# EAGLE schematic WaterLevelControl (EAGLE 9.5.2)
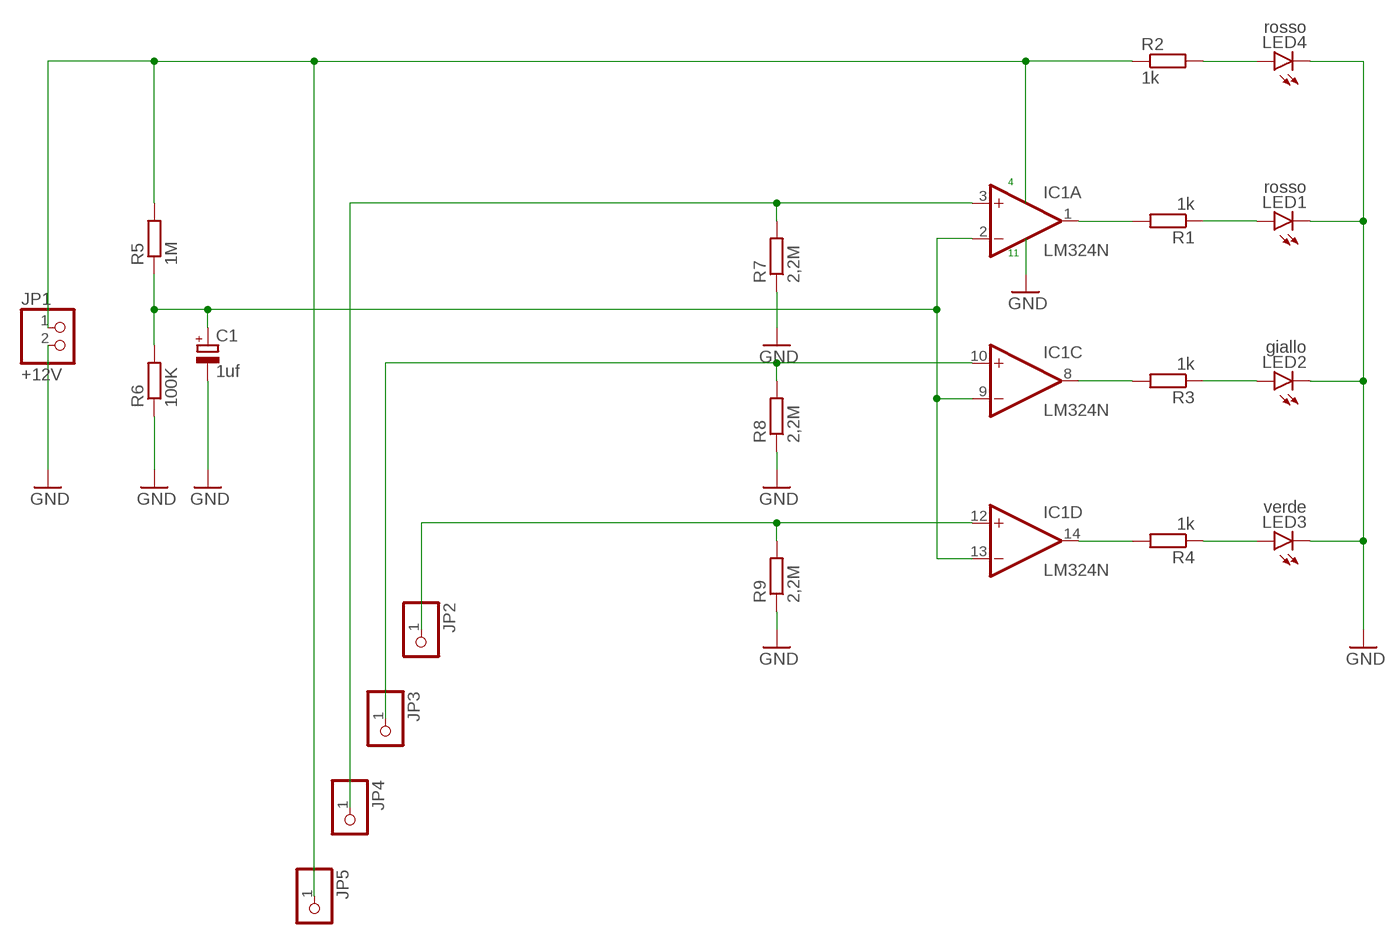
[diagram p0: schematic, sheet 1]

## Parts
C1  1uf  CPOL-EUE2.5-5  [E2,5-5]
IC1  LM324N  [DIL14]
JP1  +12V  PINHD-1X2  [1X02]
JP2  PINHD-1X1  [1X01]
JP3  PINHD-1X1  [1X01]
JP4  PINHD-1X1  [1X01]
JP5  PINHD-1X1  [1X01]
LED1  rosso  LED3MM  [LED3MM]
LED2  giallo  LED3MM  [LED3MM]
LED3  verde  LED3MM  [LED3MM]
LED4  rosso  LED3MM  [LED3MM]
R1  1k  R-EU_0207/10  [0207/10]
R2  1k  R-EU_0207/10  [0207/10]
R3  1k  R-EU_0207/10  [0207/10]
R4  1k  R-EU_0207/10  [0207/10]
R5  1M  R-EU_0207/10  [0207/10]
R6  100K  R-EU_0207/10  [0207/10]
R7  2,2M  R-EU_0207/10  [0207/10]
R8  2,2M  R-EU_0207/10  [0207/10]
R9  2,2M  R-EU_0207/10  [0207/10]

## Nets
+V: JP1.1 JP5.1 R2.1 R5.2
GND: C1.- JP1.2 LED1.K(C) LED2.K(C) LED3.K(C) LED4.K(C) R6.1 R7.1 R8.1 R9.1
N$1: IC1.3(A:+IN) JP4.1 R7.2
N$2: IC1.10(C:+IN) JP3.1 R8.2
N$3: IC1.12(D:+IN) JP2.1 R9.2
N$4: LED4.A R2.2
N$5: C1.+ IC1.2(A:-IN) IC1.9(C:-IN) IC1.13(D:-IN) R5.1 R6.2
N$7: LED1.A R1.1
N$8: LED2.A R3.1
N$9: IC1.8(C:OUT) R3.2
N$10: IC1.1(A:OUT) R1.2
N$11: IC1.14(D:OUT) R4.2
N$12: LED3.A R4.1
Unconnected: IC1.5(B:+IN) IC1.6(B:-IN) IC1.7(B:OUT)

## Notes on the sheet
- 4
- 11

## Power pins joined to a net without a drawn wire
V+: IC1.4(P:V+)
V-: IC1.11(P:V-)

## Library data of the parts
C1 = rcl-IK0JXV:CPOL-EU: POLARIZED CAPACITOR, European symbol; SPICEPREFIX: C
IC1 = linear-IK0JXV:LM324: OP AMP
JP1 = pinhead:PINHD-1X2: PIN HEADER
JP2-JP5 = pinhead:PINHD-1X1: PIN HEADER
LED1-LED4 = led-IK0JXV:LED: LED OSRAM: - CHIPLED LG R971, LG N971, LY N971, LG Q971, LY Q971, LO R971, LY R971 LH N974, LH R974 LS Q976, LO Q976, LY Q976 LO Q996 - Hyper CHIPLED LW Q18S LB Q993, LB Q99A, LB R99A - SideLED LS A670, LO A670, LY A670, LG A670, LP A670 LB A673, LV A673, LT A673, LW A673 LH A674 LY A675 LS A676, LA A676, LO A676, LY A676, LW A676 LS A679, LY A679, LG A679 - Hyper Micro SIDELED® LS Y876, LA Y876, LO Y876, LY Y876 LT Y87S - SmartLED LW L88C, LW L88S LB L89C, LB L89S, LG L890 LS L89K, LO L89K, LY L89K LS L896, LA L896, LO L896, LY L896 - TOPLED LS T670, LO T670, LY T670, LG T670, LP T670 LSG T670, LSP T670, LSY T670, LOP T670, LYG T670 LG T671, LOG T671, LSG T671 LB T673, LV T673, LT T673, LW T673 LH T674 LS T676, LA T676, LO T676, LY T676, LB T676, LH T676, LSB T676, LW T676 LB T67C, LV T67C, LT T67C, LS T67K, LO T67K, LY T67K, LW E67C LS E67B, LA E67B, LO E67B, LY E67B, LB E67C, LV E67C, LT E67C LW T67C LS T679, LY T679, LG T679 LS T770, LO T770, LY T770, LG T770, LP T770 LB T773, LV T773, LT T773, LW T773 LH T774 LS E675, LA E675, LY E675, LS T675 LS T776, LA T776, LO T776, LY T776, LB T776 LHGB T686 LT T68C, LB T68C - Hyper Mini TOPLED® LB M676 - Mini TOPLED Santana® LG M470 LS M47K, LO M47K, LY M47K Source: http://www.osram.convergy.de LUXEON: - LUMILED® LXK2-PW12-R00, LXK2-PW12-S00, LXK2-PW14-U00, LXK2-PW14-V00 LXK2-PM12-R00, LXK2-PM12-S00, LXK2-PM14-U00 LXK2-PE12-Q00, LXK2-PE12-R00, LXK2-PE12-S00, LXK2-PE14-T00, LXK2-PE14-U00 LXK2-PB12-K00, LXK2-PB12-L00, LXK2-PB12-M00, LXK2-PB14-N00, LXK2-PB14-P00, LXK2-PB14-Q00 LXK2-PR12-L00, LXK2-PR12-M00, LXK2-PR14-Q00, LXK2-PR14-R00 LXK2-PD12-Q00, LXK2-PD12-R00, LXK2-PD12-S00 LXK2-PH12-R00, LXK2-PH12-S00 LXK2-PL12-P00, LXK2-PL12-Q00, LXK2-PL12-R00 Source: www.luxeon.com KINGBRIGHT: KA-3528ASYC Source: www.kingbright.com
R1-R9 = rcl-IK0JXV:R-EU_: RESISTOR, European symbol; SPICEPREFIX: R